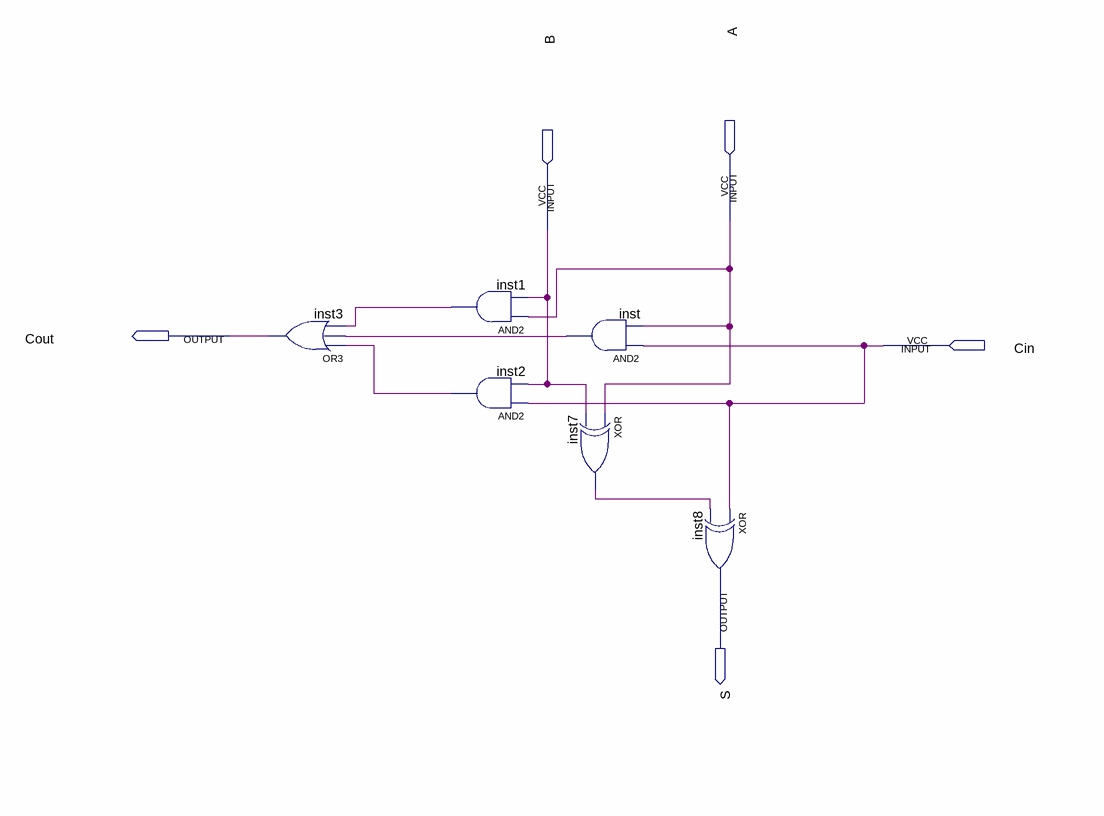
[diagram p0: schematic sheet]
// Quartus schematic FA.bdf as structural Verilog: 6 symbols, 5 pins
module FA (
  input  A,
  input  B,
  input  Cin,
  output Cout,
  output S
);

  wire inst1_out, inst2_out, inst7_out, inst_out;

  or inst3 (Cout, inst2_out, inst_out, inst1_out);
  and inst1 (inst1_out, A, B);
  and inst2 (inst2_out, Cin, B);
  and inst (inst_out, Cin, A);
  xor inst7 (inst7_out, A, B);
  xor inst8 (S, Cin, inst7_out);
endmodule
